# Altium schematic sheet lab_1_zhernakov_usb_rs232.SchDoc: =title_line_1 + title_line_2
size 594 x 420 mm; SheetNumber: n
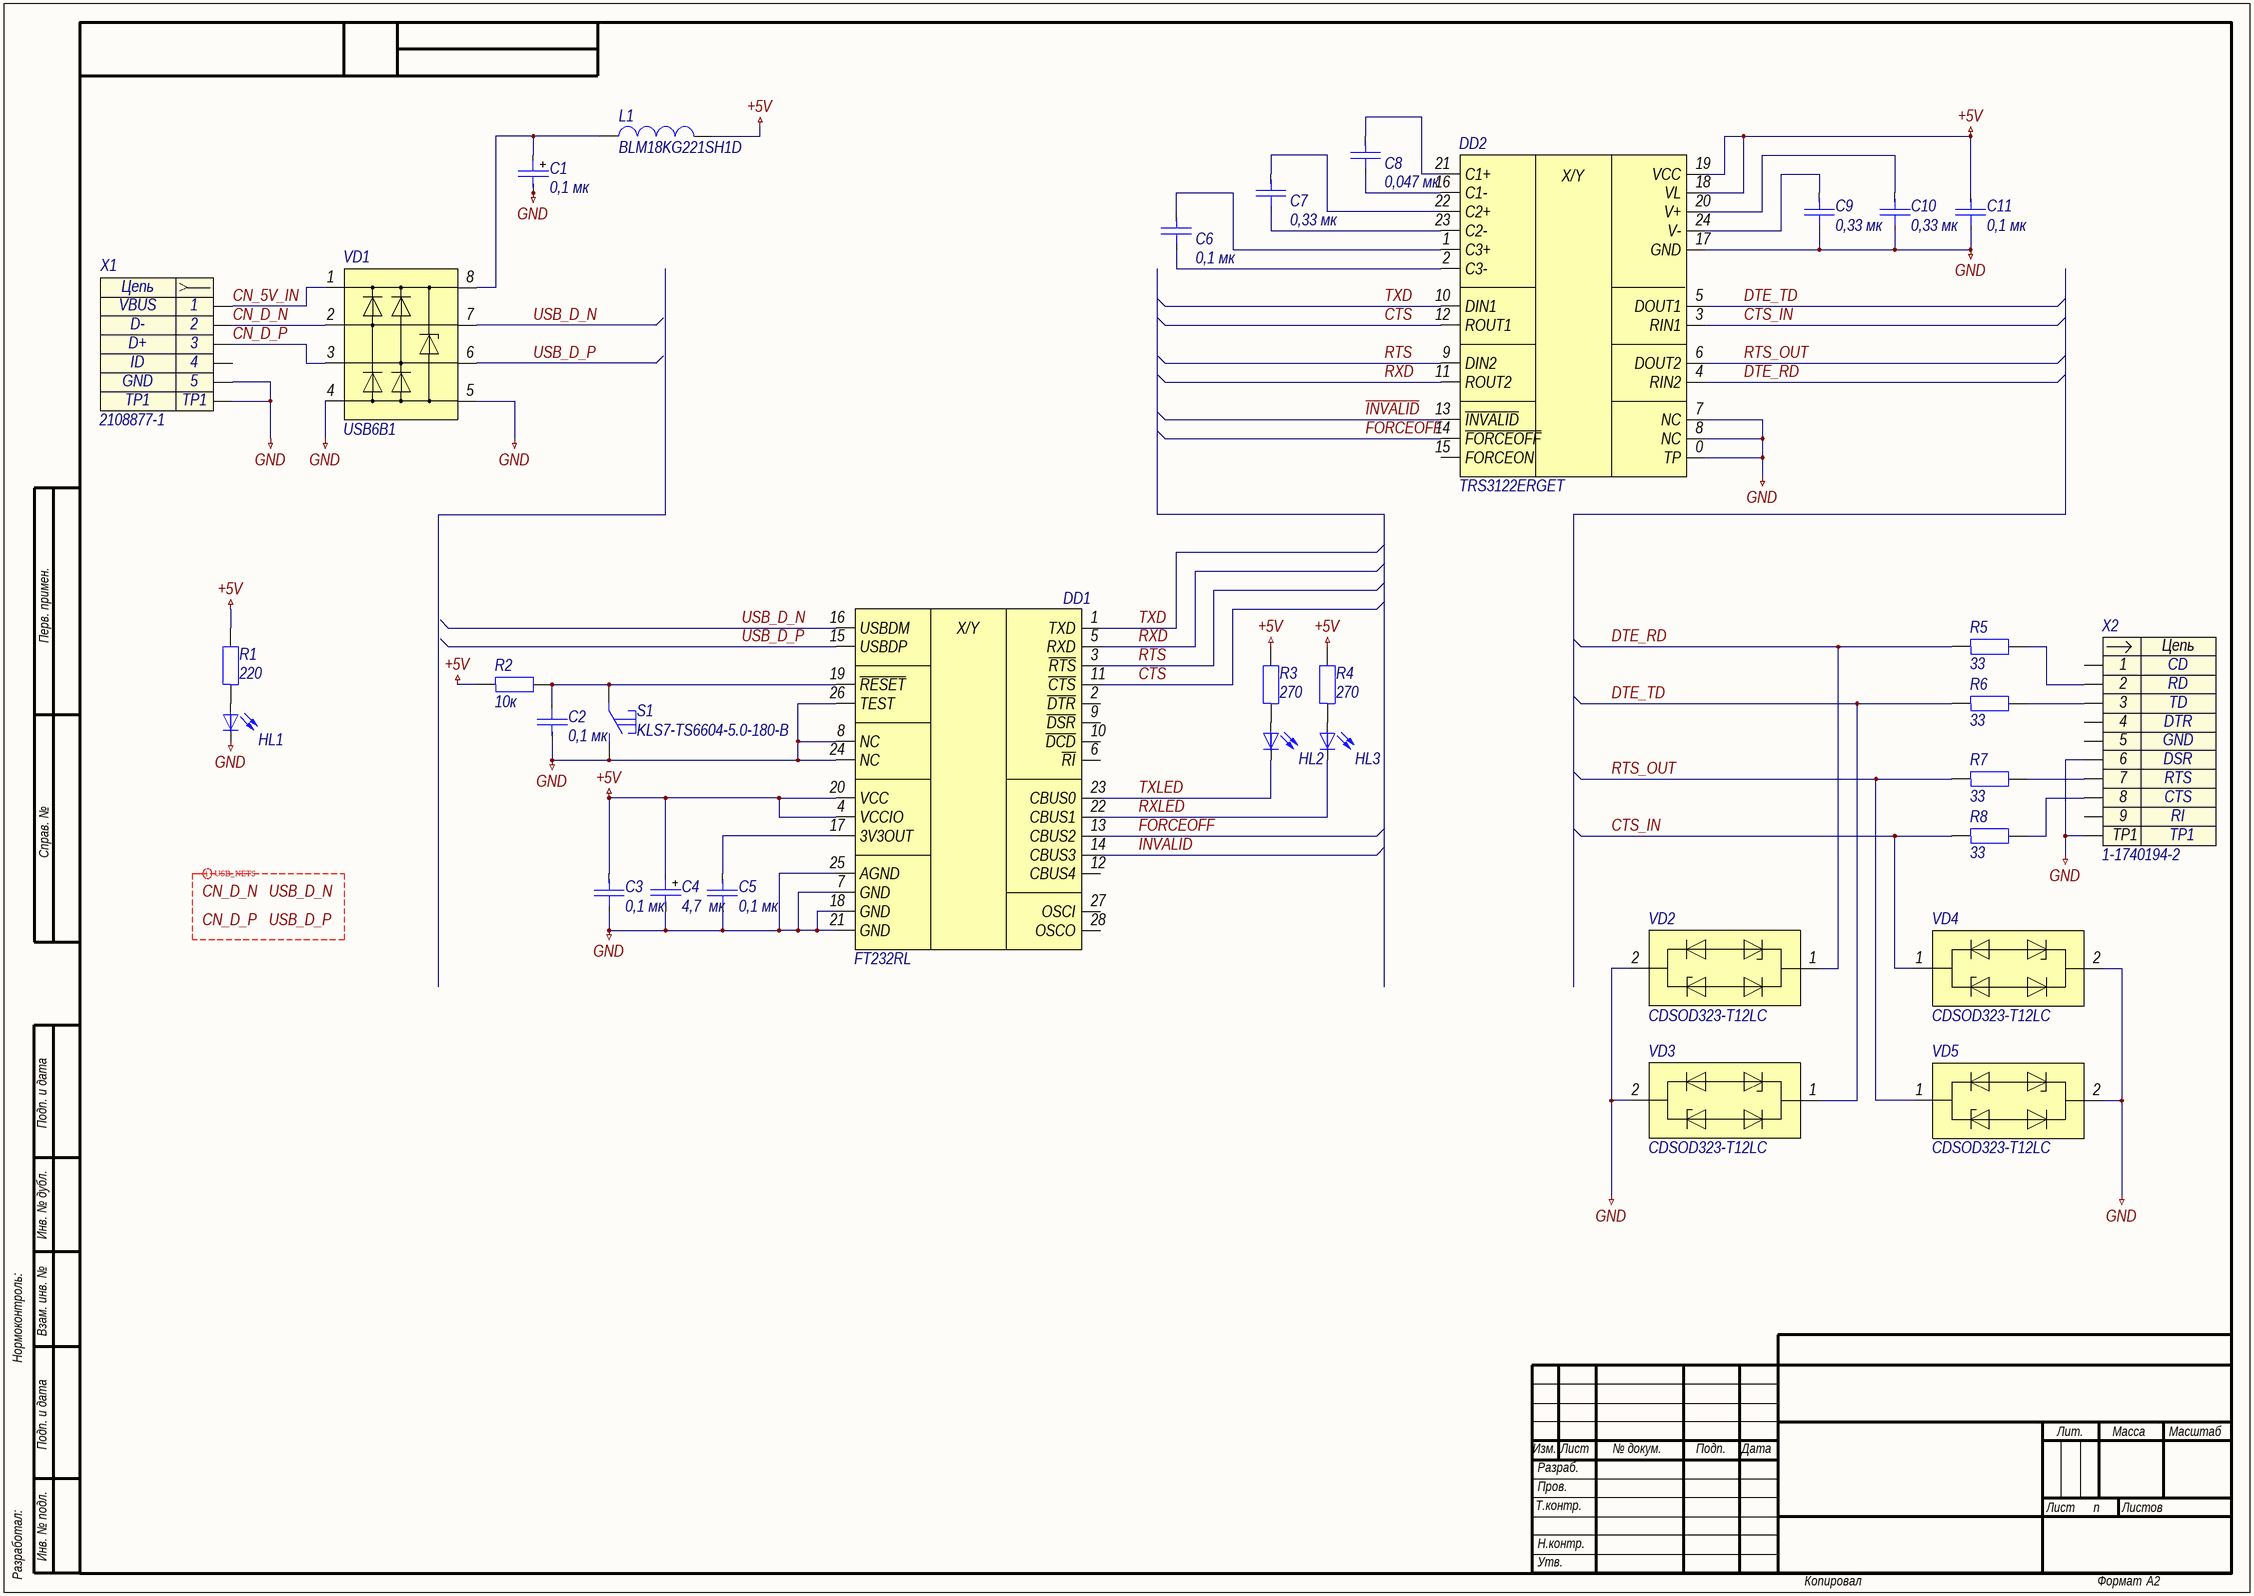
[diagram p0: lab_1_zhernakov_usb_rs232.SchDoc]

## Parts
C1  0,1 мк  [C3216-18]
C2  0,1 мк  [C0603]
C3  0,1 мк  [C0603]
C4  4,7  мк  [C3216-18]
C5  0,1 мк  [C0805]
C6  0,1 мк  [C0603]
C7  0,33 мк  [C0805]
C8  0,047 мк  [C0603]
C9  0,33 мк  [C0805]
C10  0,33 мк  [C0805]
C11  0,1 мк  [C0603]
DD1  FT232RL  [SSOP-28]
DD2  TRS3122ERGET  [QFN-24-400x400x100]
HL1  (no value)  [D0603]
HL2  (no value)  [D0603]
HL3  (no value)  [D0603]
L1  BLM18KG221SH1D  [FERRITE-BEAD]
R1  220  [R0603]
R2  10к  [R0603]
R3  270  [R0603]
R4  270  [R0603]
R5  33  [R0603]
R6  33  [R0603]
R7  33  [R0603]
R8  33  [R0603]
S1  KLS7-TS6604-5.0-180-B  [KLS7-TS6604-5.0-180-B]
VD1  USB6B1  [SO-8]
VD2  CDSOD323-T12LC  [SOD-323]
VD3  CDSOD323-T12LC  [SOD-323]
VD4  CDSOD323-T12LC  [SOD-323]
VD5  CDSOD323-T12LC  [SOD-323]
X1  2108877-1  [2108877-1]
X2  1-1740194-2  [1-1740194-2]

## Nets
+5V: C3.2 C4.1 C11.2 DD1.4(VCCIO) DD1.20(VCC) DD2.18(VL) DD2.19(VCC) L1.2 R1.2 R2.1 R3.2 R4.2
GND: C1.2 C2.2 C3.1 C4.2 C5.1 C9.1 C10.1 C11.1 DD1.7(GND) DD1.8(NC) DD1.18(GND) DD1.21(GND) DD1.24(NC) DD1.25(AGND) DD1.26(TEST) DD2.0(TP) DD2.7(NC) DD2.8(NC) DD2.17(GND) HL1.2(K) S1.2 VD1.4 VD1.5 VD2.2 VD3.2 VD4.2 VD5.2 X1.5 X1.TP1 X2.6 X2.TP1
CN_5V_IN: VD1.1 X1.1
CN_D_N: VD1.2 X1.2
CN_D_P: VD1.3 X1.3
CTS: DD1.11(~{CTS}) DD2.12(ROUT1)
CTS_IN: DD2.3(RIN1) R8.1 VD4.1
DTE_RD: DD2.4(RIN2) R5.1 VD2.1
DTE_TD: DD2.5(DOUT1) R6.1 VD3.1
~{FORCEOFF}: DD1.13(CBUS2) DD2.14(~{FORCEOFF})
~{INVALID}: DD1.14(CBUS3) DD2.13(~{INVALID})
RTS: DD1.3(~{RTS}) DD2.9(DIN2)
RTS_OUT: DD2.6(DOUT2) R7.1 VD5.1
RXD: DD1.5(RXD) DD2.11(ROUT2)
RXLED: DD1.22(CBUS1) HL3.2(K)
TXD: DD1.1(TXD) DD2.10(DIN1)
TXLED: DD1.23(CBUS0) HL2.2(K)
USB_D_N: DD1.16(USBDM) VD1.7
USB_D_P: DD1.15(USBDP) VD1.6
NetC1_1: C1.1 L1.1 VD1.8
NetC2_1: C2.1 DD1.19(~{RESET}) R2.2 S1.1
NetC5_2: C5.2 DD1.17(3V3OUT)
NetC6_1: C6.1 DD2.2(C3-)
NetC6_2: C6.2 DD2.1(C3+)
NetC7_1: C7.1 DD2.23(C2-)
NetC7_2: C7.2 DD2.22(C2+)
NetC8_1: C8.1 DD2.16(C1-)
NetC8_2: C8.2 DD2.21(C1+)
NetC9_2: C9.2 DD2.24(V-)
NetC10_2: C10.2 DD2.20(V+)
NetHL1_1: HL1.1(A) R1.1
NetHL2_1: HL2.1(A) R3.1
NetHL3_1: HL3.1(A) R4.1
NetR5_2: R5.2 X2.2
NetR6_2: R6.2 X2.3
NetR7_2: R7.2 X2.7
NetR8_2: R8.2 X2.8

Not connected (* = marked no-connect by the designer): DD1 2(~{DTR}) 6(~{RI}) 9(~{DSR}) 10(~{DCD}) 12(CBUS4) 27(OSCI) 28(OSCO); DD2 15(FORCEON); X1 4; X2 1 4 5 9

## Layout directives
differential pair; rule Differential Pairs Routing [Pref Gap = 0.254mm    Min Gap  = 0.15mm    Max Gap  = 0.254mmPref Width = 0.381mm    Min Width  = 0.155mm    Max Width  = 0.381mm]; differential pair class USB_SIGNALS: CN_D_N, CN_D_P, USB_D_N, USB_D_P

## Notes on the sheet
- Labels drawn without touching a wire or pin: CN_D_N, CN_D_P, USB_D_N, USB_D_P
- Перв. примен.
- Справ. №
- Подп. и дата
- Инв. № дубл.
- Нормоконтроль:
- Взам. инв. №
- Изм.
- Лист
- № докум.
- Подп.
- Дата
- Лит.
- Масса
- Масштаб
- Т.контр.
- Пров.
- Разраб.
- Листов
- Разработал:
- Инв. № подл.
- Н.контр.
- Утв.
- Копировал
- Формат
- А2
- (in symbol 2108877-1_micro_usb-b) Цепь
- (in symbol dd0012) X/Y
- (in symbol dd0015) X/Y
- (in symbol x0002) Цепь

## Library data of the parts
C1 = c0006: =Описание; ID: c0006; Фамилия: Жернаков; Описание: Конденсатор полярный; Наименование: 293D 104 X5 025 A 2WE3; Производитель: Vishay; Отклонение: ±10 %; Номинальное напряжение: 25 В; Рабочие температуры: от -55 °С до +125 °С; Корпус: 3216-18; Номинал: 0,1 мк; HelpURL: https://www.vishay.com/docs/40002/293d.pdf
C2 C3 C5 C6 C11 = c0002: =Описание; ID: c0002; Фамилия: Жернаков; Описание: Конденсатор; Наименование: CL10B104JB8NNNC; Производитель: Samsung electro-mechanics; Отклонение: ±5 %; Номинальное напряжение: 50 В; Рабочие температуры: от -55 °С до +125 °С; Корпус: 0603; Номинал: 0,1 мк; HelpURL: http://product.samsungsem.com/mlcc/CL10B104JB8NNN.do
C4 = c0005: =Описание; ID: c0005; Фамилия: Жернаков; Описание: Конденсатор полярный; Производитель: Vishay; Отклонение: ±5 %; Номинальное напряжение: 25 В; Рабочие температуры: от -55 °С до +125 °С; Корпус: 3216-18; Номинал: 4,7  мк
C7 C9 C10 = c0003: =Описание; ID: c0003; Фамилия: Жернаков; Описание: Конденсатор; Наименование: CL21B334KBFNFNE; Производитель: Samsung electro-mechanics; Отклонение: ±10 %; Номинальное напряжение: 50 В; Рабочие температуры: от -55 °С до +125 °С; Корпус: 0805; Номинал: 0,33 мк; HelpURL: http://product.samsungsem.com/mlcc/CL21B334KBFNFN.do
C8 = с0004: =Описание; ID: с0004; Фамилия: Жернаков; Описание: Конденсатор; Наименование: CL10B473JB8NNNC; Производитель: Samsung electro-mechanics; Отклонение: ±5 %; Номинальное напряжение: 50 В; Рабочие температуры: от -55 °С до +125 °С; Корпус: 0603; Номинал: 0,047 мк; HelpURL: http://product.samsungsem.com/mlcc/CL10B473JB8NNN.do
DD1 = dd0015: =Описание; ID: dd0015; Фамилия: Жернаков; Описание: Преобразователь USB-UART; Производитель: FTDI Limited; Наименование: FT232RL; Корпус: SSOP-28; HelpURL: https://ftdichip.com/products/ft232rl/
DD2 = dd0012: =Описание; ID: dd0012; Фамилия: Жернаков; Описание: Приемопередатчик RS-232; Производитель: Texas Instruments; Корпус: QFN-24; Наименование: TRS3122ERGET; HelpURL: https://www.ti.com/product/TRS3122E
HL1-HL3 = vd0001: =Описание; ID: vd0001; Фамилия: Жернаков; Описание: Светодиод
L1 = l0001: =Описание; ID: l0001; Фамилия: Жернаков; Описание: Ферритовая бусина 220 Ом ±25 %; Производитель: Murata Manufacturing Co., Ltd.; Номинал: 220 Ом; Отклонение: ±25 %; Рабочие температуры: от -55 °С до +125 °С; Корпус: 0603; Наименование: BLM18KG221SH1D; HelpURL: https://www.murata.com/en-global/products/productdetail.aspx?partno=BLM18KG221SH1%23
R1 = r0004: =Описание; ID: r0004; Фамилия: Жернаков; Описание: Резистор; Наименование: RC0603F221CS; Производитель: Samsung; Отклонение: ±1 %; Номинальное напряжение: 25 В; Рабочие температуры: от -55 °С до +150 °С; Номинальный ток: 0,5 А; Корпус: '0603; Номинал: 220
R2 = r0003: =Описание; ID: r0003; Фамилия: Жернаков; Описание: Резистор; Наименование: RC0603F103CS; Производитель: Samsung; Отклонение: ±1 %; Номинальное напряжение: 25 В; Рабочие температуры: от -55 °С до +150 °С; Номинальный ток: 0,5 А; Корпус: 0603; Номинал: 10к
R3 R4 = r0005: =Описание; ID: r0005; Фамилия: Жернаков; Описание: Резистор; Наименование: RC0603F271CS; Производитель: Samsung; Отклонение: ±1 %; Номинальное напряжение: 25 В; Рабочие температуры: от -55 °С до +150 °С; Номинальный ток: 0,5 А; Корпус: 0603; Номинал: 270; HelpURL: http://product.samsungsem.com/cr/RC0603F271CS.do
R5-R8 = r0006: =Описание; ID: r0006; Фамилия: Жернаков; Описание: Резистор 33 Ом; Наименование: RC0603F330CS; Производитель: Samsung; Отклонение: ±1 %; Номинальное напряжение: 25 В; Рабочие температуры: от -55 °С до +150 °С; Номинальный ток: 0,5 А; Корпус: 0603; Номинал: 33; HelpURL: http://product.samsungsem.com/cr/RC0603F330CS.do
S1 = s0006: =Описание; ID: s0006; Фамилия: Паньков; Описание: Тактовая кнопка поверхностного монтажа; Производитель: KLS; Ток нагрузки: 50 мА @ 12 В; Сопротивление контакта: 50 мОм; Количество контактов: 4; Рабочие температуры: от –20 °С до +70 °С; Промывка: Запрещена; Корпус: 6,00 x 6,00 x 3,50; Наименование: KLS7-TS6604-5.0-180-B; HelpURL: http://www.klsele.com/products/Switches/Tact-Switches-Series/939.html
VD1 = asmvd0007: Фамилия: Жернаков; Описание: Защита от перенапряжений; ID: asmvd0007; Наименование: USB6B1; Корпус: SO-8
VD2-VD5 = vd0014: =Описание; ID: vd0014; Фамилия: Жернаков; Описание: Двунаправленная диодная сборка для подавления помех, 12 В; Производитель: Bourns; Наименование: CDSOD323-T12LC; Корпус: SOD-323; HelpURL: https://www.bourns.com/products/diodes/tvs-diodes/product/CDSOD323-TxxLC%20Series
X1 = 2108877-1_micro_usb-b: Contact_1: VBUS; Contact_2: D-; Contact_3: D+; Contact_4: ID; Contact_5: GND; Наименование: 2108877-1
X2 = x0002: Contact_1: CD; Contact_2: RD; Contact_3: TD; Contact_4: DTR; Contact_5: GND; Contact_6: DSR; Contact_7: RTS; Contact_8: CTS; Contact_9: RI; ID: x0002; Фамилия: Ларионов; Описание: D-Sub 9 pin Board-to-Board; Производитель: TE Connectivity; Наименование: 1-1740194-2; HelpURL: https://www.te.com/global-en/product-1-1740194-2.html